# EAGLE design Uno (EAGLE 6.1)
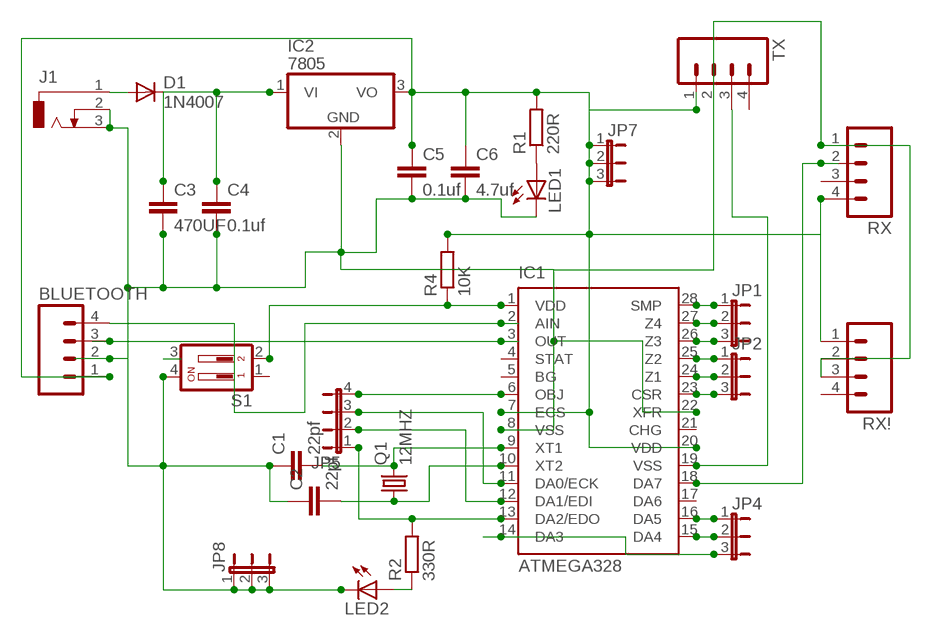
[diagram p0: schematic, sheet 1]

## Parts
BLUETOOTH  M04  [04P]
C1  22pf  C2.5/2  [C2.5-2]
C2  22pf  C2.5/2  [C2.5-2]
C3  470UF  C2.5/2  [C2.5-2]
C4  0.1uf  C2.5/2  [C2.5-2]
C5  0.1uf  C2.5/2  [C2.5-2]
C6  4.7uf  C2.5/2  [C2.5-2]
D1  1N4007  1N4004  [DO41-10]
IC1  ATMEGA328  QT9701BD  [DIL28-3]
IC2  7805  786TV  [TO220V]
J1  DCJ0303  [DCJ0303]
JP1  JP2E  [JP2]
JP2  JP2E  [JP2]
JP4  JP2E  [JP2]
JP5  JP4E  [JP4]
JP7  JP2E  [JP2]
JP8  JP2E  [JP2]
LED1  LED3MM  [LED3MM]
LED2  LED3MM  [LED3MM]
Q1  12MHZ  CRYSTALHC49S  [HC49/S]
R1  220R  R-EU_0207/10  [0207/10]
R2  330R  R-EU_0207/10  [0207/10]
R4  10K  R-EU_0207/10  [0207/10]
RX  M04  [04P]
RX!  M04  [04P]
S1  DP02  [DP-02]
TX  M04  [04P]

## Nets
N$1: C1.2 IC1.9(XT1) Q1.2
N$2: C2.2 IC1.10(XT2) Q1.1
N$3: D1.A J1.1
N$4: BLUETOOTH.1 C5.1 C6.1 IC1.7(ECS) IC1.20(VDD) IC2.3(VO) JP7.1 JP7.2 JP7.3 R1.2 R4.2 RX!.1 RX.4 TX.1
N$5: BLUETOOTH.2 C1.1 C2.1 C3.2 C4.2 C5.2 C6.2 IC1.8(VSS) IC1.22(XFR) IC2.2(GND) J1.2 J1.3 JP8.1 JP8.2 JP8.3 LED1.K(C) LED2.K(C) RX!.2 RX!.3 RX.1 S1.4 TX.2
N$6: LED1.A R1.1
N$7: C3.1 C4.1 D1.C IC2.1(VI)
N$8: IC1.28(SMP) JP1.1
N$9: IC1.27(Z4) JP1.2
N$10: IC1.26(Z3) JP1.3
N$11: IC1.25(Z2) JP2.1
N$12: IC1.24(Z1) JP2.2
N$13: IC1.23(CSR) JP2.3
N$14: BLUETOOTH.4 IC1.2(AIN)
N$15: S1.3
N$17: BLUETOOTH.3 IC1.3(OUT)
N$18: IC1.6(OBJ) JP5.4
N$19: IC1.12(DA1/EDI) JP5.2
N$20: IC1.11(DA0/ECK) JP5.3
N$21: IC1.13(DA2/EDO) JP5.1 R2.2
N$22: IC1.14(DA3) JP4.3
N$23: IC1.15(DA4) JP4.2
N$24: IC1.16(DA5) JP4.1
N$26: IC1.18(DA7) RX.2
N$27: IC1.19(VSS) TX.3
N$31: IC1.1(VDD) R4.1 S1.2
N$32: LED2.A R2.1
Unconnected: IC1.4(STAT) IC1.5(BG) IC1.17(DA6) IC1.21(CHG) RX!.4 RX.3 S1.1 TX.4

## Library data of the parts
BLUETOOTH RX RX! TX = con-amp-quick:M04: AMP QUICK CONNECTOR; OC_FARNELL: unknown; OC_NEWARK: unknown
C1-C6 = capacitor-wima:C: CAPACITOR naming: grid - package width
D1 = diode:1N4004: DIODE general purpose rectifier, 1 A
IC1 = quantum-research-group:QT9701B: Charge-Transfer Capacitance Sensor IC Source: http://data.qprox.com/downloads/datasheets/qt9701b.pdf; OC_FARNELL: unknown; OC_NEWARK: unknown
IC2 = linear:78*: Positive VOLTAGE REGULATOR Source: http://cache.national.com/ds/LM/LM78L05.pdf http://www.fairchildsemi.com/ds/LM/LM7805.pdf
J1 = con-jack:DCJ0303: DC POWER JACK Source: DCJ0303.pdf; OC_FARNELL: unknown; OC_NEWARK: unknown
JP1 JP2 JP4 JP7 JP8 = jumper:JP2E: JUMPER
JP5 = jumper:JP4E: JUMPER
LED1 LED2 = led:LED: LED OSRAM: - CHIPLED LG R971, LG N971, LY N971, LG Q971, LY Q971, LO R971, LY R971 LH N974, LH R974 LS Q976, LO Q976, LY Q976 LO Q996 - Hyper CHIPLED LW Q18S LB Q993, LB Q99A, LB R99A - SideLED LS A670, LO A670, LY A670, LG A670, LP A670 LB A673, LV A673, LT A673, LW A673 LH A674 LY A675 LS A676, LA A676, LO A676, LY A676, LW A676 LS A679, LY A679, LG A679 - Hyper Micro SIDELED® LS Y876, LA Y876, LO Y876, LY Y876 LT Y87S - SmartLED LW L88C, LW L88S LB L89C, LB L89S, LG L890 LS L89K, LO L89K, LY L89K LS L896, LA L896, LO L896, LY L896 - TOPLED LS T670, LO T670, LY T670, LG T670, LP T670 LSG T670, LSP T670, LSY T670, LOP T670, LYG T670 LG T671, LOG T671, LSG T671 LB T673, LV T673, LT T673, LW T673 LH T674 LS T676, LA T676, LO T676, LY T676, LB T676, LH T676, LSB T676, LW T676 LB T67C, LV T67C, LT T67C, LS T67K, LO T67K, LY T67K, LW E67C LS E67B, LA E67B, LO E67B, LY E67B, LB E67C, LV E67C, LT E67C LW T67C LS T679, LY T679, LG T679 LS T770, LO T770, LY T770, LG T770, LP T770 LB T773, LV T773, LT T773, LW T773 LH T774 LS E675, LA E675, LY E675, LS T675 LS T776, LA T776, LO T776, LY T776, LB T776 LHGB T686 LT T68C, LB T68C - Hyper Mini TOPLED® LB M676 - Mini TOPLED Santana® LG M470 LS M47K, LO M47K, LY M47K Source: http://www.osram.convergy.de LUXEON: - LUMILED® LXK2-PW12-R00, LXK2-PW12-S00, LXK2-PW14-U00, LXK2-PW14-V00 LXK2-PM12-R00, LXK2-PM12-S00, LXK2-PM14-U00 LXK2-PE12-Q00, LXK2-PE12-R00, LXK2-PE12-S00, LXK2-PE14-T00, LXK2-PE14-U00 LXK2-PB12-K00, LXK2-PB12-L00, LXK2-PB12-M00, LXK2-PB14-N00, LXK2-PB14-P00, LXK2-PB14-Q00 LXK2-PR12-L00, LXK2-PR12-M00, LXK2-PR14-Q00, LXK2-PR14-R00 LXK2-PD12-Q00, LXK2-PD12-R00, LXK2-PD12-S00 LXK2-PH12-R00, LXK2-PH12-S00 LXK2-PL12-P00, LXK2-PL12-Q00, LXK2-PL12-R00 Source: www.luxeon.com KINGBRIGHT: KA-3528ASYC Source: www.kingbright.com
Q1 = crystal:CRYSTAL: CRYSTAL; OC_FARNELL: 1667008; OC_NEWARK: unknown
R1 R2 R4 = rcl:R-EU_: RESISTOR, European symbol
S1 = switch-dil:DP02: DIL/CODE SWITCH; MPN: MCDP02; OC_FARNELL: 1255233; OC_NEWARK: 26M1095

## Board
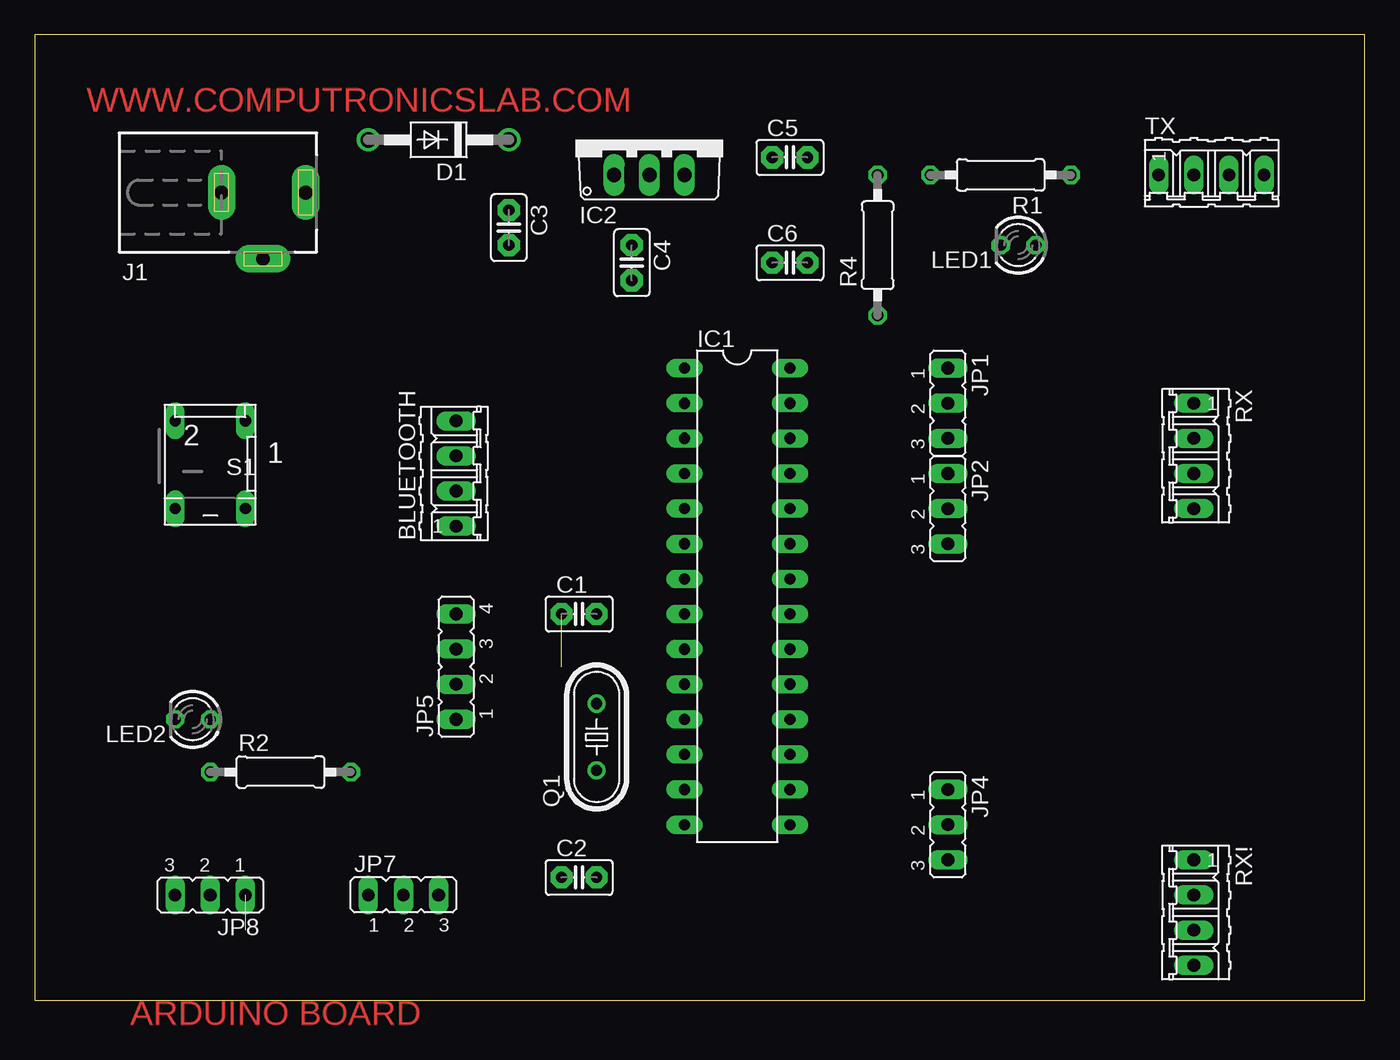
[diagram p1: board, top side]
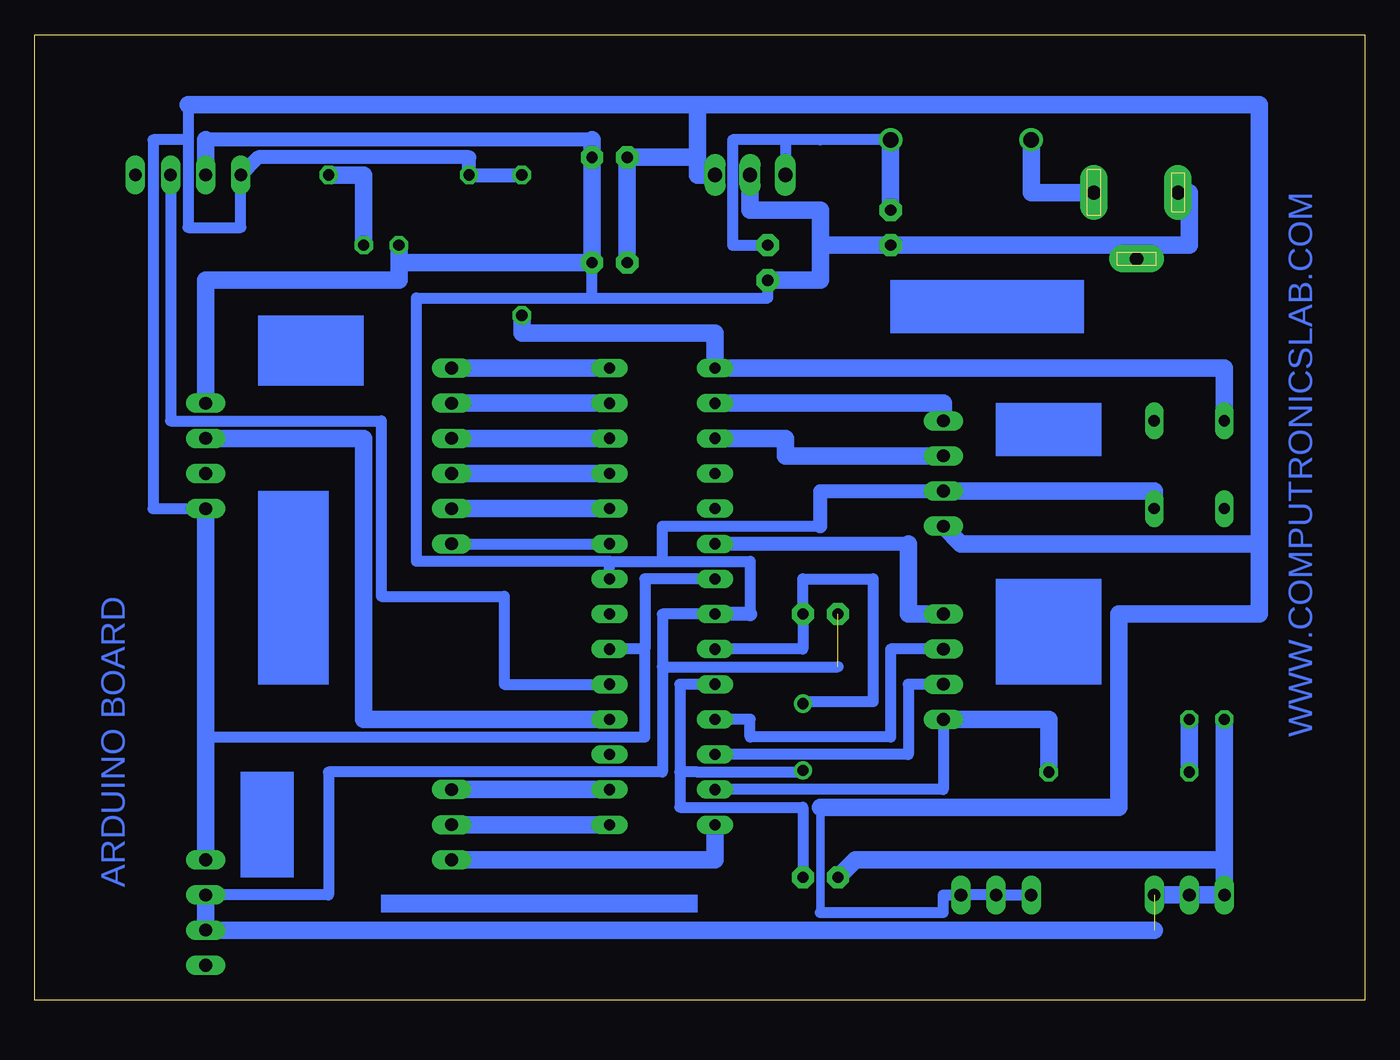
[diagram p2: board, bottom side, seen from below]

Size 96.19 x 69.84 mm. Coordinates in mm from the lower left corner, seen from the top.
Outline: 0,0 96.19,0 96.19,69.84 0,69.84 0,0
Copper layers (1*16): Top 0.035mm / dielectric 1.5mm / Bottom 0.035mm
Design rules: minimum track width 20mil, minimum drill 24mil, track to track 8mil, track to pad 8mil, pad to pad 8mil, via to via 8mil, smd to smd 8mil, copper to edge 40mil, drill to drill 8mil, minimum pad ring 10mil, minimum via ring 8mil, stop-mask expansion 4mil, vias tented up to drill 0mil, thermal gap 10mil

### Footprints (pad centres in the part's own frame; a part is rotated, then mirrored left to right if it is on the bottom)
04P = drill 0.914 long: 1 -3.81,0; 2 -1.27,0; 3 1.27,0; 4 3.81,0
C2.5-2 = drill 0.813 pad 1.6 octagon: 1 -1.27,0; 2 1.27,0
DO41-10 = drill 1.118: A 5.08,0; C -5.08,0
DIL28-3 = drill 0.813 long: 1 -16.51,-3.81; 2 -13.97,-3.81; 3 -11.43,-3.81; 4 -8.89,-3.81; 5 -6.35,-3.81; 6 -3.81,-3.81; 7 -1.27,-3.81; 8 1.27,-3.81; 9 3.81,-3.81; 10 6.35,-3.81; 11 8.89,-3.81; 12 11.43,-3.81; 13 13.97,-3.81; 14 16.51,-3.81; 15 16.51,3.81; 16 13.97,3.81; 17 11.43,3.81; 18 8.89,3.81; 19 6.35,3.81; 20 3.81,3.81; 21 1.27,3.81; 22 -1.27,3.81; 23 -3.81,3.81; 24 -6.35,3.81; 25 -8.89,3.81; 26 -11.43,3.81; 27 -13.97,3.81; 28 -16.51,3.81
TO220V = drill 1.016 long: 1 -2.54,-2.54; 2 0,-2.54; 3 2.54,-2.54
DCJ0303 = drill 1 pad 2 long: 1 0,3.1; 2 4.8,0; 3 0,-3
JP2 = drill 0.914 long: 1 -2.54,0; 2 0,0; 3 2.54,0
JP4 = drill 0.914 long: 1 -3.81,0; 2 -1.27,0; 3 1.27,0; 4 3.81,0
LED3MM = drill 0.813 octagon: A -1.27,0; K 1.27,0
HC49/S = drill 0.813: 1 -2.413,0; 2 2.413,0
0207/10 = drill 0.813 octagon: 1 -5.08,0; 2 5.08,0
DP-02 = drill 0.813 long: 1 -2.54,-2.54; 2 2.54,-2.54; 3 2.54,3.81; 4 -2.54,3.81

### Placement (x,y rotation side)
BLUETOOTH  30.48,38.1 90 top
C1  39.37,27.94 0 top
C2  39.37,8.89 0 top
C3  34.29,55.88 270 top
C4  43.18,53.34 270 top
C5  54.61,60.96 0 top
C6  54.61,53.34 0 top
D1  29.21,62.23 180 top
IC1  50.8,29.21 270 top
IC2  44.45,62.23 0 top
J1  16.51,58.42 270 top
JP1  66.04,43.18 270 top
JP2  66.04,35.56 270 top
JP4  66.04,12.7 270 top
JP5  30.48,24.13 90 top
JP7  26.67,7.62 0 top
JP8  12.7,7.62 180 top
LED1  71.12,54.61 180 top
LED2  11.43,20.32 180 top
Q1  40.64,19.05 90 top
R1  69.85,59.69 180 top
R2  17.78,16.51 0 top
R4  60.96,54.61 90 top
RX  83.82,39.37 270 top
RX!  83.82,6.35 270 top
S1  12.7,39.37 180 top
TX  85.09,59.69 0 top

### Tracks (layer width: path | path; a pad name or v marks a point on that pad's centre or on a via)
N$1
  Bottom 0.508: 40.64,21.59 Q1.2
  Bottom 0.813: 40.64,21.59 35.56,21.59 35.56,30.48 40.64,30.48 C1.2 40.64,25.4 IC1.9
N$2
  Bottom 0.508: 40.64,16.51 Q1.1
  Bottom 0.813: 40.64,16.51 48.26,16.51 49.53,16.51 | 49.53,16.51 49.53,22.86 IC1.10 | C2.2 40.64,13.97 49.53,13.97 49.53,16.51
N$3
  Bottom 1.27: J1.1 24.13,58.42 D1.A
N$4
  Bottom 0.61: 39.37,13.97 39.37,6.35
  Bottom 0.813: 52.07,25.4 52.07,30.48 IC1.7 | 52.07,25.4 IC1.20 | 52.07,25.4 52.07,19.05 83.82,19.05 | JP7.1 JP7.2 JP7.3 30.48,7.62 30.48,6.35 39.37,6.35 | TX.1 81.28,55.88 85.09,55.88 85.09,62.23 | 85.09,64.77 85.09,62.23 | RX.4 87.63,35.56 87.63,62.23 85.09,62.23
  Bottom 1.016: R4.2 R1.2 64.77,60.96 80.01,60.96 TX.1
  Bottom 1.27: RX.4 83.82,19.05 RX!.1 | 48.26,60.96 48.26,59.69 IC2.3 | 48.26,60.96 C5.1 C6.1 | 39.37,13.97 17.78,13.97 17.78,27.94 7.62,27.94 7.62,33.02 | 7.62,33.02 7.62,64.77 48.26,64.77 | 48.26,60.96 48.26,64.77 | 48.26,64.77 85.09,64.77 | BLUETOOTH.1 29.21,33.02 7.62,33.02
N$5  (2 unrouted)
  Bottom 0.813: 55.88,50.8 43.18,50.8 C4.2 | 44.45,27.94 44.45,31.75 50.8,31.75 | 54.61,31.75 50.8,31.75 | IC1.22 54.61,31.75 | 50.8,24.13 38.1,24.13 | 50.8,24.13 50.8,27.94 IC1.8 | RX!.2 74.93,7.62 74.93,16.51 50.8,16.51 50.8,24.13 | 39.37,34.29 50.8,34.29 50.8,31.75 | 55.88,50.8 C6.2 | 55.88,50.8 68.58,50.8 68.58,31.75 54.61,31.75
  Bottom 1.016: 55.88,62.23 83.82,62.23 | 44.45,27.94 IC1.8 | 39.37,34.29 39.37,36.83 BLUETOOTH.2
  Bottom 1.27: 16.51,54.61 12.7,54.61 12.7,58.42 J1.3 | IC2.2 44.45,57.15 39.37,57.15 39.37,54.61 | 39.37,54.61 C3.2 16.51,54.61 | 39.37,54.61 39.37,52.07 C4.2 | 16.51,54.61 J1.2 | 83.82,62.23 TX.2 | 55.88,62.23 C5.2 C6.2 69.85,53.34 | 69.85,53.34 LED1.K | 69.85,53.34 69.85,52.07 83.82,52.07 RX.1 | BLUETOOTH.2 15.24,36.83 S1.4 | RX!.2 RX!.3 15.24,5.08 | 10.16,10.16 JP8.3 JP8.2 JP8.1 | 10.16,10.16 LED2.K | C2.1 36.83,10.16 10.16,10.16
N$6
  Bottom 1.27: LED1.A 72.39,59.69 R1.1
N$7
  Bottom 0.508: 39.37,62.23 41.91,62.23
  Bottom 0.813: 41.91,62.23 IC2.1 | D1.C 39.37,62.23 45.72,62.23 45.72,54.61 C4.1
  Bottom 1.27: D1.C C3.1
N$8
  Bottom 1.27: JP1.1 IC1.28
N$9
  Bottom 1.27: JP1.2 IC1.27
N$10
  Bottom 1.27: JP1.3 IC1.26
N$11
  Bottom 1.27: JP2.1 IC1.25
N$12
  Bottom 1.27: JP2.2 IC1.24
N$13
  Bottom 0.813: JP2.3 IC1.23
N$14
  Bottom 1.27: IC1.2 30.48,43.18 BLUETOOTH.4
N$17
  Bottom 1.27: IC1.3 41.91,40.64 41.91,39.37 BLUETOOTH.3
N$18
  Bottom 1.016: 33.02,33.02 IC1.6
  Bottom 1.27: JP5.4 33.02,27.94 33.02,33.02
N$19
  Bottom 0.813: IC1.12 33.02,17.78 33.02,22.86 JP5.2
N$20
  Bottom 0.813: IC1.11 44.45,20.32 44.45,19.05 34.29,19.05 34.29,25.4 JP5.3
N$21
  Bottom 0.813: IC1.13 30.48,15.24 JP5.1
  Bottom 1.27: R2.2 22.86,20.32 JP5.1
N$22
  Bottom 1.27: IC1.14 46.99,10.16 JP4.3
N$23
  Bottom 1.27: JP4.2 IC1.15
N$24
  Bottom 1.27: JP4.1 IC1.16
N$26
  Bottom 1.27: IC1.18 72.39,20.32 72.39,40.64 RX.2
N$27
  Bottom 0.813: IC1.19 62.23,22.86 62.23,29.21 71.12,29.21 71.12,41.91 86.36,41.91 TX.3
N$31
  Bottom 1.27: S1.2 10.16,45.72 IC1.1 46.99,48.26 60.96,48.26 R4.1
N$32
  Bottom 1.27: LED2.A R2.1
(copper drawn outside any net)
  shapes: Bottom area x7

### Text on the board
Top: WWW.COMPUTRONICSLAB.COM | ARDUINO BOARD
Bottom: ARDUINO BOARD | WWW.COMPUTRONICSLAB.COM